# EAGLE schematic RS232_NPN_PNP_FTDI232 (EAGLE 7.6.0)
RS232 Adapter using NPN and PNP Transistors
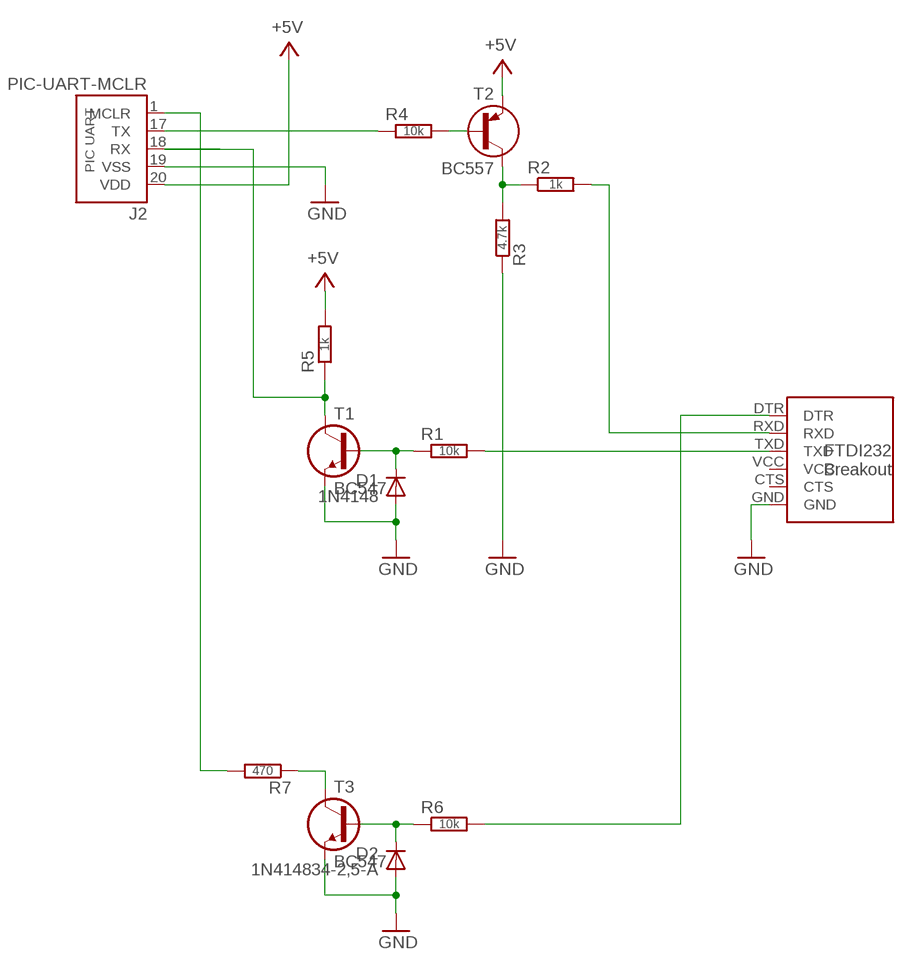
[diagram p0: schematic, sheet 1]

## Parts
D1  1N4148  1N414834-5  [DO34-5]
D2  1N414834-2,5-A  [DO34-2,5-A]
J1  FTDI232-BO-R  [FTDI232-BO-L]
J2  PIC-UART-MCLR  [PIC-UART-MCLR]
R1  10k  R0202/5  [0202/5]
R2  1k  R0202/10  [0202/10]
R3  4.7k  R0202/5  [0202/5]
R4  10k  R0202/7-V  [0202/7-V]
R5  1k  R0202/5-V  [0202/5-V]
R6  10k  R0202/7-V  [0202/7-V]
R7  470  R0202/7-V  [0202/7-V]
T1  BC547  BC547CBE  [TO92-CBE]
T2  BC557  BC557CBE  [TO92-CBE]
T3  BC547  BC547CBE  [TO92-CBE]

## Nets
+5V: J2.20(VDD) R5.2 T2.E
GND: D1.A D2.A J1.GND J2.19(VSS) R3.1 T1.E T3.E
N$1: J2.18(RX) R5.1 T1.C
N$2: D1.C R1.1 T1.B
N$3: J1.TXD R1.2
N$4: J2.17(TX) R4.1
N$5: R4.2 T2.B
N$6: R2.1 R3.2 T2.C
N$7: J1.RXD R2.2
N$8: J2.1(MCLR) R7.2
N$9: D2.C R6.1 T3.B
N$10: J1.DTR R6.2
N$11: R7.1 T3.C
Unconnected: J1.CTS J1.VCC

## Library data of the parts
D1 D2 = d:1N4148
J1 = pinconn:FTDI232-BO
J2 = pinconn:PIC-UART-MCLR
R1-R7 = r:R: RESISTOR, European symbol
T1 T3 = t:BC547
T2 = t:BC557